# EAGLE design brick_analog_button_large (EAGLE 7.4.0)
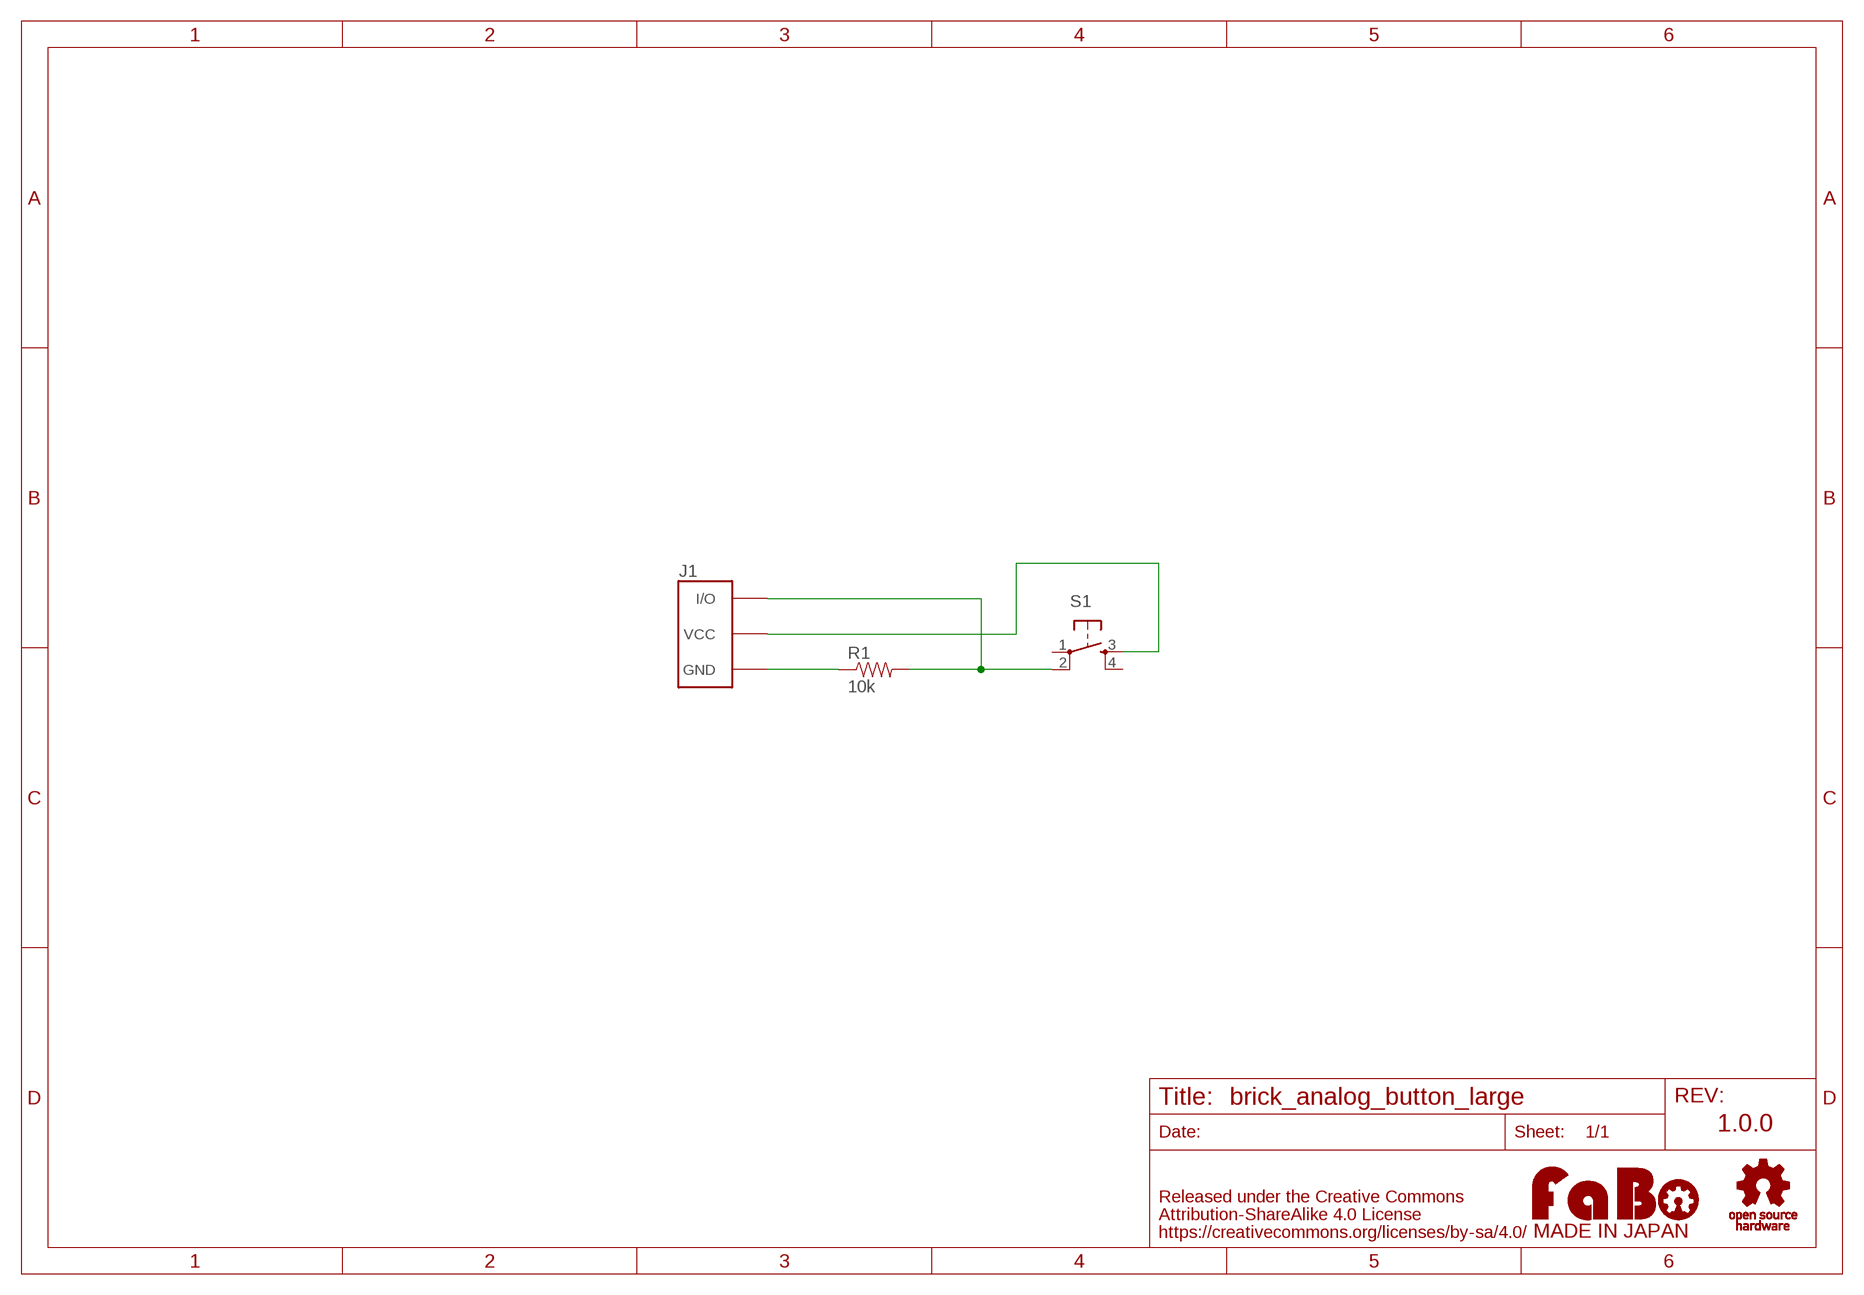
[diagram p0: schematic, sheet 1]

## Parts
J1  FABO_BRICK_3PIN  [FABO_BRICK_3PIN]
R1  10k  RES-PTH-REGULAR  [RES-AXL-REGULAR]
S1  SWITCH-TACT-12MM  [1273HA-160G-G]
U$2  LOGO_FABO-M  [LOGO_FABO_M]
U$3  LOGO_OSHW-M_BOTTOM  [LOGO_OSHW_M_BOTTOM]

## Nets
GND: J1.GND R1.P$1
N$1: J1.VCC S1.3
N$4: J1.IN/OUT(I/O) R1.P$2 S1.2
Unconnected: S1.1 S1.4

## Notes on the sheet
- 1.0.0

## Library data of the parts
J1 = FaBo-Template:FABO_BRICK_3PIN: FaBo Brick 3pin
R1 = FaBo-etc:RES
S1 = FaBo-etc:SWITCH-TACT
U$2 = FaBo-etc:LOGO_FABO
U$3 = FaBo-etc:LOGO_OSHW

## Board
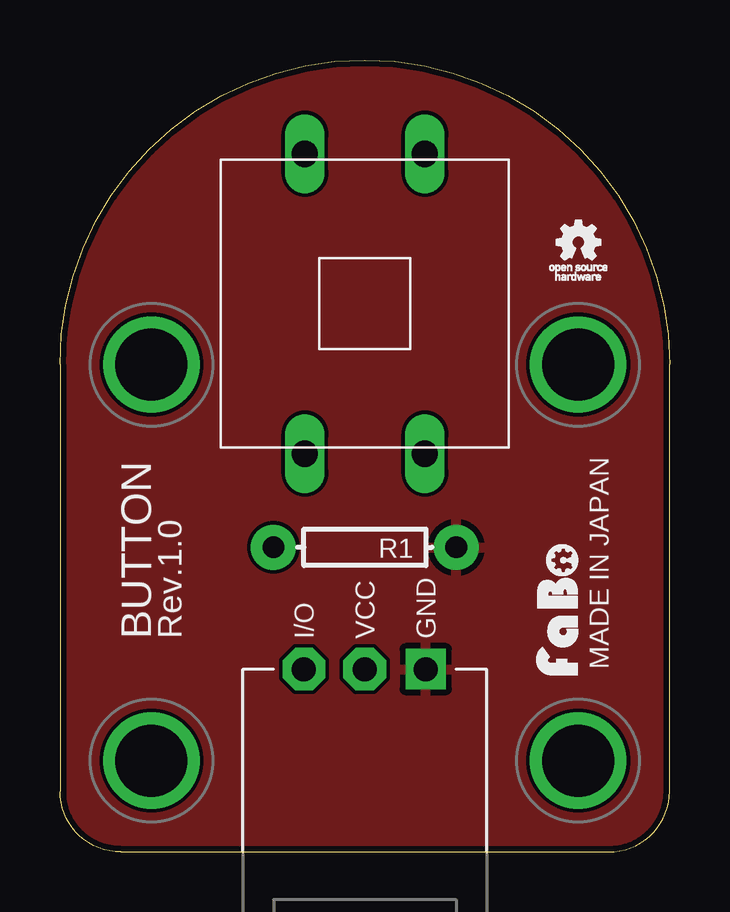
[diagram p1: board, top side]
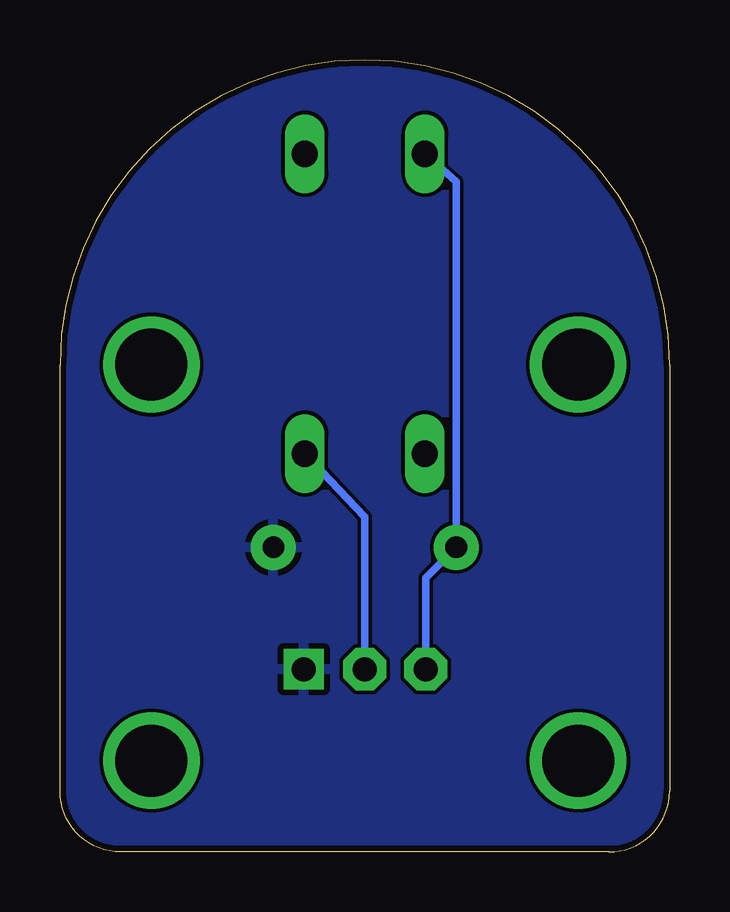
[diagram p2: board, bottom side, seen from below]

Size 25.4 x 33.02 mm. Coordinates in mm from the lower left corner, seen from the top.
Copper layers (1*16): Top 0.035mm / dielectric 1.5mm / Bottom 0.035mm
Design rules "Elecrow_2-layer_eagle_rule": minimum track width 6mil, minimum drill 12mil, track to track 6mil, track to pad 6mil, pad to pad 6mil, via to via 6mil, smd to smd 0mil, copper to edge 10mil, drill to drill 10mil, minimum pad ring 10mil, minimum via ring 6mil, stop-mask expansion 2mil, vias tented up to drill 100mil, thermal gap 10mil

### Footprints (pad centres in the part's own frame; a part is rotated, then mirrored left to right if it is on the bottom)
BRICK_3PIN = drill 1 pad 1.676 square: GND 2.54,-8.89 | drill 1 pad 1.778 octagon: IN/OUT -2.54,-8.89; VCC 0,-8.89 | drill 3 pad 3.81: P$5 -8.89,3.81; P$6 8.89,3.81; P$7 -8.89,-12.7; P$8 8.89,-12.7
RES-AXL-REGULAR = drill 0.9 pad 1.88: P$1 -3.81,0; P$2 3.81,0
1273HA-160G-G = drill 1.1 long: 1 -6.25,2.5; 2 6.25,2.5; 3 -6.25,-2.5; 4 6.25,-2.5

### Placement (x,y rotation side)
J1  [BRICK_3PIN]  12.7,16.51 0 top
R1  12.7,12.7 180 top
S1  12.7,22.86 90 top
U$2  [LOGO_FABO_S]  21.59,10.16 90 top
U$3  [LOGO_OSHW_T_S]  21.59,25.4 0 top

### Tracks (layer width: path | path; a pad name or v marks a point on that pad's centre or on a via)
GND
  pour Bottom: -1.27,-1.27 26.67,-1.27 26.67,34.29 -1.27,34.29
  pour Top: -1.27,-1.27 26.67,-1.27 26.67,34.29 -1.27,34.29
N$1
  Bottom 0.305: J1.VCC 12.7,13.97 S1.3
N$4
  Bottom 0.305: J1.IN/OUT 10.16,11.43 R1.P$2 8.89,27.94 S1.2

### Text on the board
tPlace: BUTTON | Rev.1.0 | MADE IN JAPAN